# EAGLE design shield_digitales (EAGLE 7.6.0)
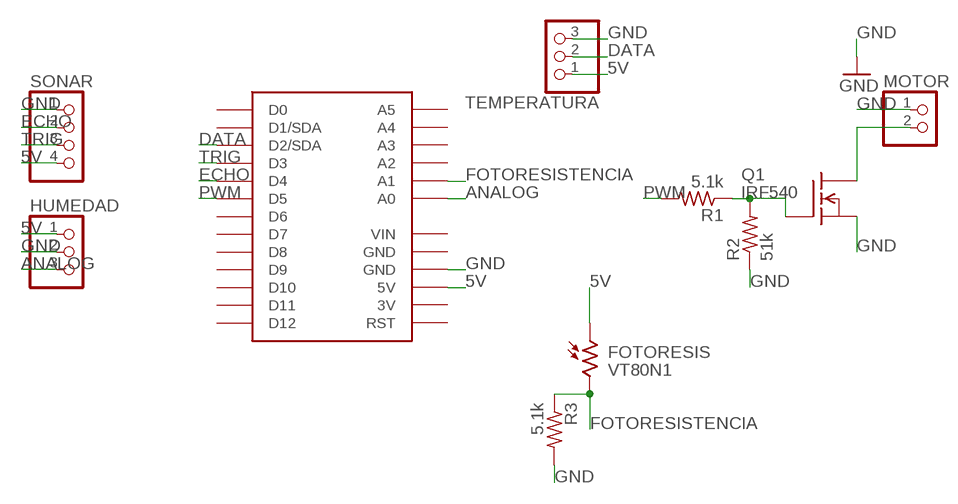
[diagram p0: schematic, sheet 1]

## Parts
FOTORESIS  VT80N1  [VT800]
HUMEDAD  PINHD-1X3  [1X03]
MOTOR  PINHD-1X2  [1X02]
Q1  IRF540  [TO220]
R1  5.1k  R-US_0207/10  [0207/10]
R2  51k  R-US_0207/10  [0207/10]
R3  5.1k  R-US_0207/10  [0207/10]
SONAR  PINHD-1X4  [1X04]
TEMPERATURA  PINHD-1X3  [1X03]
U1  YUN_MINI_SHIELD-BPLACE  [YUN_MINI_SHIELD]

## Nets
5V: FOTORESIS.1 HUMEDAD.1 SONAR.4 TEMPERATURA.1 U1.5V
ANALOG: HUMEDAD.3 U1.A0
DATA: TEMPERATURA.2 U1.D2(D2/SDA)
ECHO: SONAR.2 U1.D4
FOTORESISTENCIA: FOTORESIS.2 R3.1 U1.A1
GND: HUMEDAD.2 MOTOR.1 Q1.3(S) R2.1 R3.2 SONAR.1 TEMPERATURA.3 U1.GND2(GND)
N$1: Q1.1(G) R1.1 R2.2
N$2: MOTOR.2 Q1.2(D)
PWM: R1.2 U1.D5
TRIG: SONAR.3 U1.D3
Unconnected: U1.A2 U1.A3 U1.A4 U1.A5 U1.D0 U1.D1(D1/SDA) U1.D6 U1.D7 U1.D8 U1.D9 U1.D10 U1.D11 U1.D12 U1.RESET(RST)

## Power pins joined to a net without a drawn wire
3V: U1.3V
GND: U1.GND1(GND)
VIN: U1.VIN

## Library data of the parts
FOTORESIS = photo-elements:VT8: Photoconductive Cell VT800 Series Source: http://optoelectronics.perkinelmer.com/content/Datasheets/DTS_vt800seriesdatasheet.pdf
HUMEDAD TEMPERATURA = pinhead:PINHD-1X3: PIN HEADER
MOTOR = pinhead:PINHD-1X2: PIN HEADER
Q1 = transistor-fet:IRF540: N-Channel Enhancement MOSFET (HEXFET); 100V; 28A; 0,077Ohm
R1-R3 = rcl:R-US_: RESISTOR, American symbol
SONAR = pinhead:PINHD-1X4: PIN HEADER
U1 = uchile_robotics_eagle_library_YUN:YUN_MINI_SHIELD: Arduino YUN mini shield. Originally taken from Adafruit's UNO R3 shield.

## Board
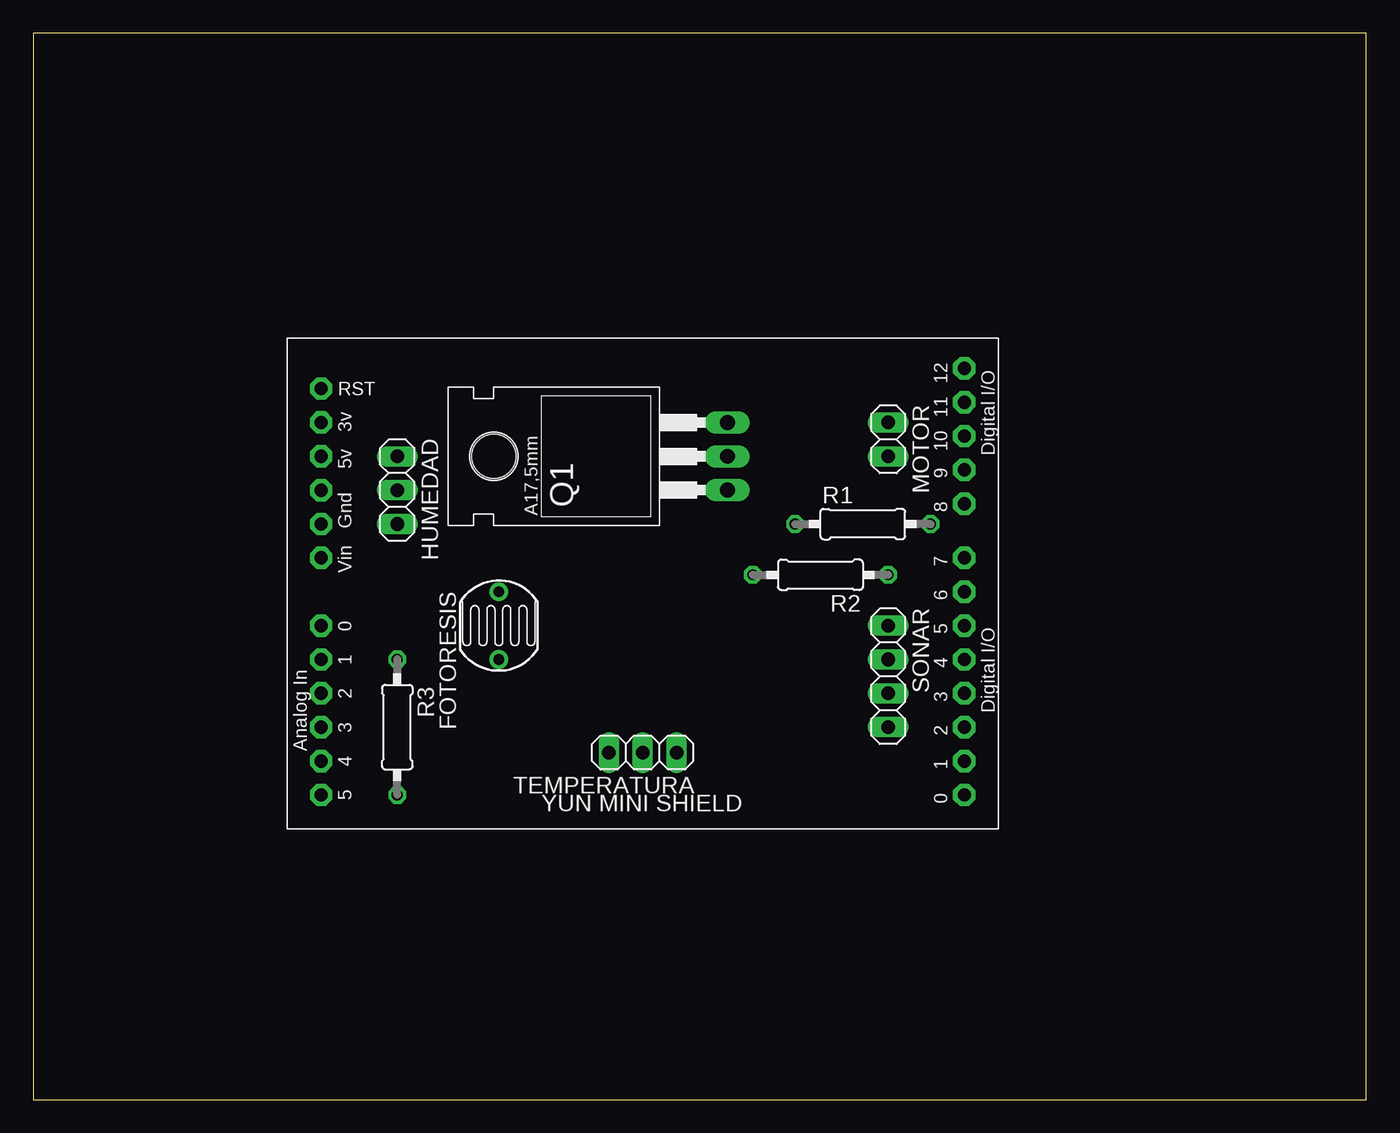
[diagram p1: board, top side]
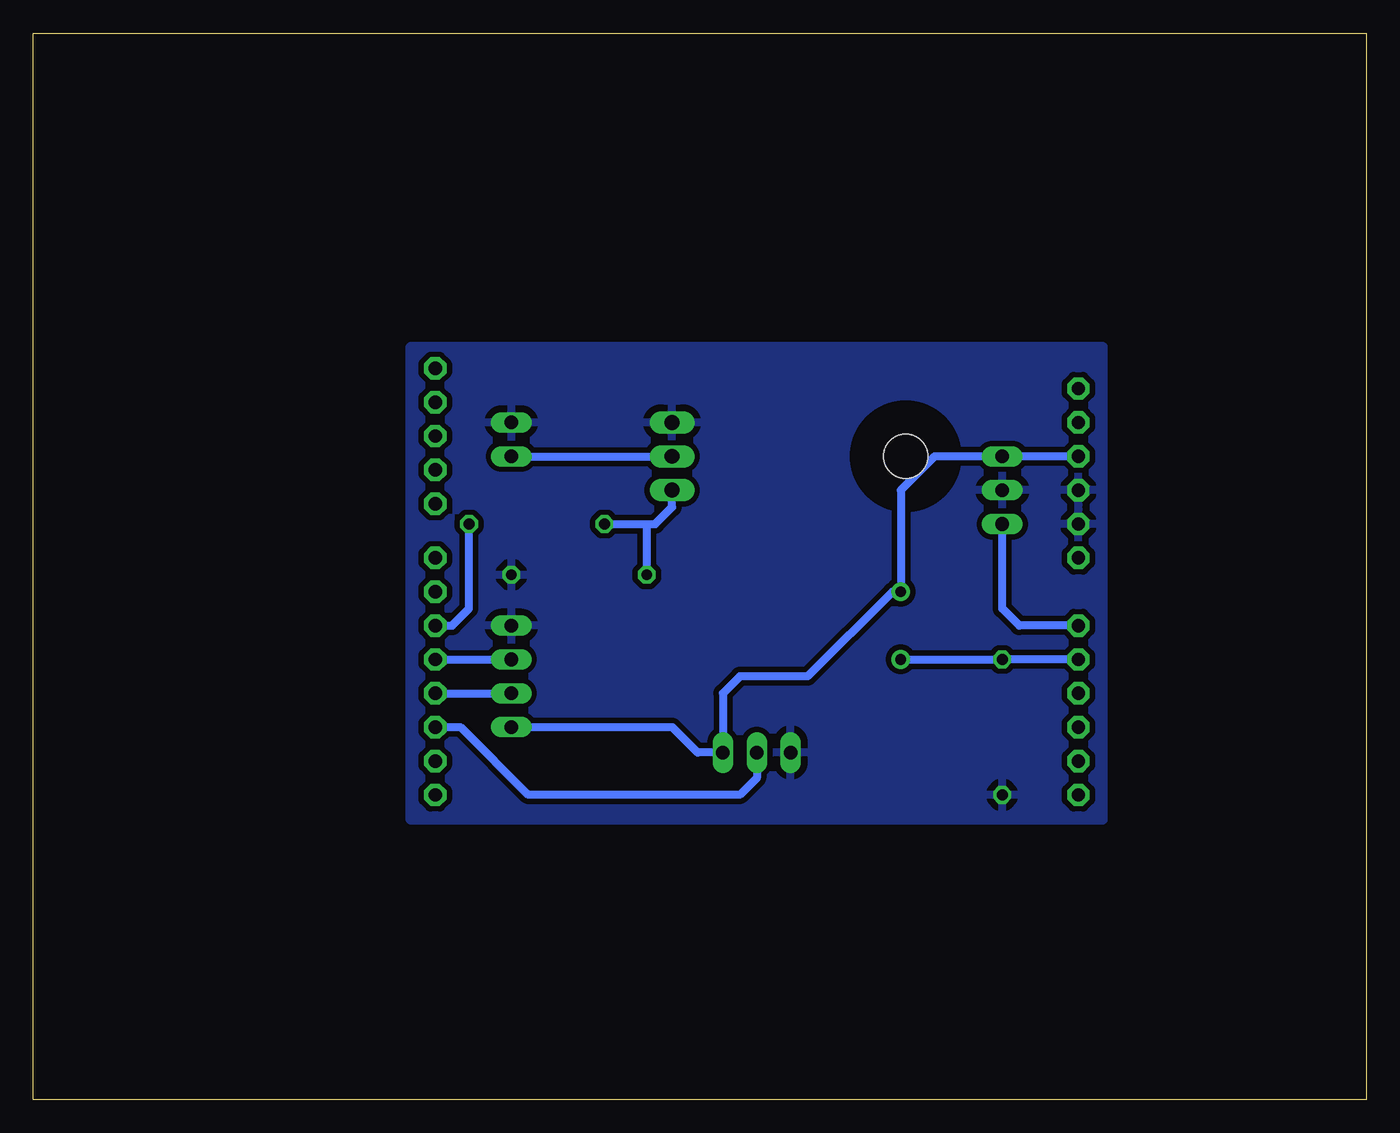
[diagram p2: board, bottom side, seen from below]

Size 100 x 80 mm. Coordinates in mm from the lower left corner, seen from the top.
Outline: 0,0 100,0 100,80 0,80 0,0
Copper layers (1*16): Top 0.035mm / dielectric 1.5mm / Bottom 0.035mm
Design rules "default *": minimum track width 10mil, minimum drill 24mil, track to track 16mil, track to pad 16mil, pad to pad 16mil, via to via 16mil, smd to smd 16mil, copper to edge 40mil, drill to drill 8mil, minimum pad ring 10mil, minimum via ring 8mil, stop-mask expansion 4mil, vias tented up to drill 0mil, thermal gap 20mil

### Footprints (pad centres in the part's own frame; a part is rotated, then mirrored left to right if it is on the bottom)
VT800 = drill 0.8 pad 1.4: 1 -2.54,0; 2 2.54,0
1X03 = drill 1.016 long: 1 -2.54,0; 2 0,0; 3 2.54,0
1X02 = drill 1.016 long: 1 -1.27,0; 2 1.27,0
TO220 = drill 1.118 long: 1 -2.54,-6.35; 2 0,-6.35; 3 2.54,-6.35 | hole 3.302: 0,11.176
0207/10 = drill 0.813 octagon: 1 -5.08,0; 2 5.08,0
1X04 = drill 1.016 long: 1 -3.81,0; 2 -1.27,0; 3 1.27,0; 4 3.81,0
YUN_MINI_SHIELD = drill 1 pad 1.676 octagon: 3V 35.56,2.54; 5V 38.1,2.54; A0 50.8,2.54; A1 53.34,2.54; A2 55.88,2.54; A3 58.42,2.54; A4 60.96,2.54; A5 63.5,2.54; D0 63.5,50.8; D1 60.96,50.8; D2 58.42,50.8; D3 55.88,50.8; D4 53.34,50.8; D5 50.8,50.8; D6 48.26,50.8; D7 45.72,50.8; D8 41.656,50.8; D9 39.116,50.8; D10 36.576,50.8; D11 34.036,50.8; D12 31.496,50.8; GND1 43.18,2.54; GND2 40.64,2.54; RESET 33.02,2.54; VIN 45.72,2.54

### Placement (x,y rotation side)
FOTORESIS  34.92,35.56 270 top
HUMEDAD  27.3,45.72 270 top
MOTOR  64.14,49.53 270 top
Q1  45.72,48.26 90 top
R1  62.23,43.18 0 top
R2  59.05,39.37 180 top
R3  27.3,27.94 270 top
SONAR  64.14,31.75 270 top
TEMPERATURA  45.72,26.04 180 top
U1  19.05,86.36 270 top

### Tracks (layer width: path | path; a pad name or v marks a point on that pad's centre or on a via)
5V
  Bottom 0.61: U1.5V HUMEDAD.1 32.38,48.26 34.92,45.72 FOTORESIS.1 35.56,38.1 41.91,31.75 46.99,31.75 48.26,30.48 TEMPERATURA.1 50.16,26.04 52.07,27.94 SONAR.4
ANALOG
  Bottom 0.61: U1.A0 26.04,35.56 27.3,36.83 HUMEDAD.3
DATA
  Bottom 0.61: U1.D2 67.94,27.94 62.87,22.86 46.99,22.86 45.72,24.13 TEMPERATURA.2
ECHO
  Bottom 0.61: U1.D4 SONAR.2
FOTORESISTENCIA
  Bottom 0.61: U1.A1 R3.1 FOTORESIS.2
GND
  pour Bottom: 71.75,56.52 71.75,41.91 71.75,20.95
  pour Bottom: 19.68,56.52 71.75,56.52 71.75,48.9 71.75,20.95 19.68,20.95
N$1
  Bottom 0.61: R1.1 53.98,43.18 | 53.98,43.18 53.34,43.18 52.07,44.45 Q1.1 | R2.2 53.98,43.18
N$2
  Bottom 0.61: MOTOR.2 Q1.2
PWM
  Bottom 0.61: R1.2 67.31,36.83 68.58,35.56 U1.D5
TRIG
  Bottom 0.61: U1.D3 SONAR.3